# EAGLE schematic Lightcontrol (EAGLE 7.3.0)
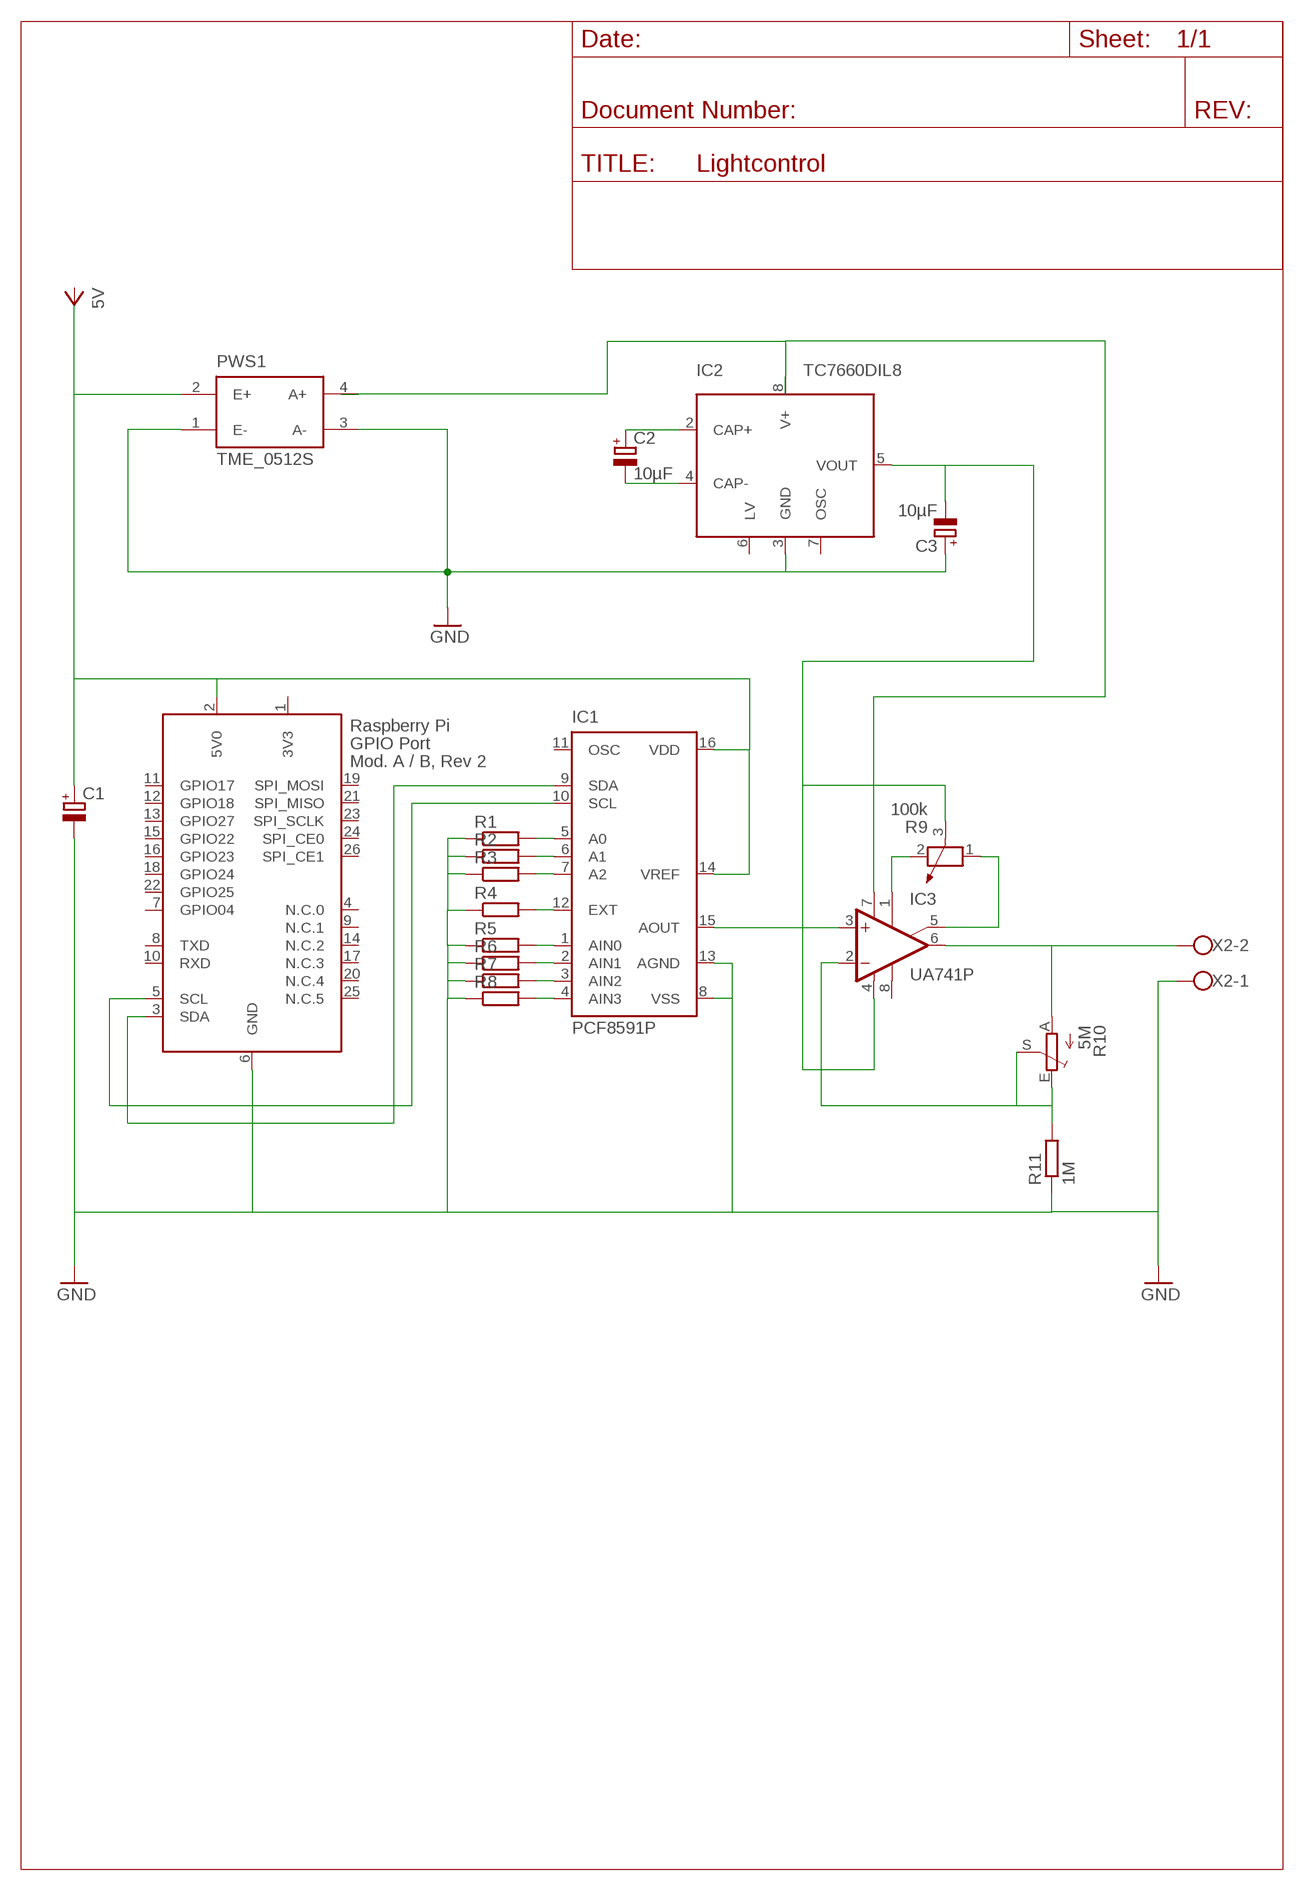
[diagram p0: schematic, sheet 1]

## Parts
C1  CPOL-EUE1.8-4  [E1,8-4]
C2  10µF  CPOL-EUE1.8-4  [E1,8-4]
C3  10µF  CPOL-EUE1.8-4  [E1,8-4]
IC1  PCF8591P  [DIL16]
IC2  TC7660DIL8  [DIL8]
IC3  UA741P  [DIL08]
PWS1  TME_0512S  [TMEXXXXS]
R1  R-EU_0204/5  [0204/5]
R2  R-EU_0204/5  [0204/5]
R3  R-EU_0204/5  [0204/5]
R4  R-EU_0204/5  [0204/5]
R5  R-EU_0204/5  [0204/5]
R6  R-EU_0204/5  [0204/5]
R7  R-EU_0204/5  [0204/5]
R8  R-EU_0204/5  [0204/5]
R9  100k  POTENTIOMETER_PT-10S  [PT-10S]
R10  5M  TRIM_EU-ST15  [ST15]
R11  1M  R-EU_0204/5  [0204/5]
X1  RASPI_GPIO_AB_PIN  [RASPI_GPIO_AB_PIN]
X2  W237-102  [W237-102]

## Nets
GND: C1.- C3.+ IC1.8(VSS) IC1.13(AGND) IC2.3(GND) PWS1.1(E-) PWS1.3(A-) R1.1 R2.1 R3.1 R4.1 R5.1 R6.1 R7.1 R8.1 R11.1 X1.6(GND) X2.1
N$1: IC1.15(AOUT) IC3.3(+IN)
N$2: IC3.1(ON1) R9.2
N$3: C3.- IC2.5(VOUT) IC3.4(V-) R9.3
N$4: IC1.9(SDA) X1.3(SDA)
N$5: IC1.10(SCL) X1.5(SCL)
N$6: IC1.5(A0) R1.2
N$7: IC1.6(A1) R2.2
N$8: IC1.7(A2) R3.2
N$9: IC1.12(EXT) R4.2
N$10: IC1.1(AIN0) R5.2
N$11: IC1.2(AIN1) R6.2
N$12: IC1.3(AIN2) R7.2
N$13: IC1.4(AIN3) R8.2
N$14: IC3.5(ON2) R9.1
N$15: C1.+ IC1.14(VREF) IC1.16(VDD) PWS1.2(E+) X1.2(5V0)
N$19: IC3.6(OUT) R10.A X2.2
N$21: IC3.2(-IN) R10.E R10.S R11.2
N$23: IC2.8(V+) IC3.7(V+) PWS1.4(A+)
N$25: C2.+ IC2.2(CAP+)
N$26: C2.- IC2.4(CAP-)
Unconnected: IC1.11(OSC) IC2.6(LV) IC2.7(OSC) IC3.8(OPT) X1.4(N.C.0) X1.7(GPIO04) X1.8(TXD) X1.9(N.C.1) X1.10(RXD) X1.11(GPIO17) X1.12(GPIO18) X1.13(GPIO27) X1.14(N.C.2) X1.15(GPIO22) X1.16(GPIO23) X1.17(N.C.3) X1.18(GPIO24) X1.19(SPI_MOSI) X1.20(N.C.4) X1.21(SPI_MISO) X1.22(GPIO25) X1.23(SPI_SCLK) X1.24(SPI_CE0) X1.25(N.C.5) X1.26(SPI_CE1)

## Power pins joined to a net without a drawn wire
3V3: X1.1(3V3)

## Library data of the parts
C1-C3 = resistor:CPOL-EU: POLARIZED CAPACITOR, European symbol
IC1 = micro-philips:PCF8591: I2C-Bus D/A CONVERTER; MF: FARNELL; MPN: PCF8591P; OC_FARNELL: 396412; OC_NEWARK: 07WX3385
IC2 = microchip_tc7660:TC7660: TC7660 Charge Pump DC-to-DC Voltage Converter
IC3 = linear:*741: OP AMP
PWS1 = traco-electronic:TME_*S: DC/DC Konverter 1 Watt Source: http://www.tracopower.com/datasheet_g/tme-d.pdf; MPN: TME 0512S; OC_FARNELL: 1007540; OC_NEWARK: 51R5323
R1-R8 R11 = rcl:R-EU_: RESISTOR, European symbol
R9 = rcl:POTENTIOMETER_: Potentiometer
R10 = pot:TRIM_EU-: POTENTIOMETER
X1 = raspberrypi_bastelstube_v13:RASPI_GPIO_AB: Only the 2x13 header connector, nothing else
X2 = con-wago-500:W237-102: WAGO SCREW CLAMP; MPN: 237-102; OC_FARNELL: unknown; OC_NEWARK: 70K9898